# Altium schematic sheet LORA.SchDoc
size A; SheetNumber: 6; SheetTotal: 6
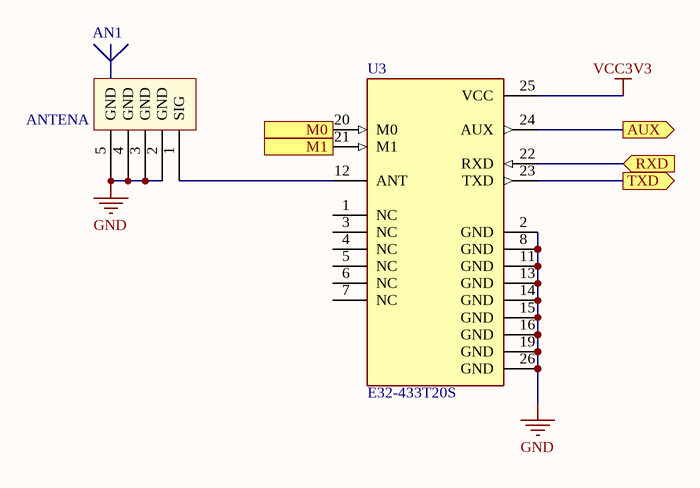
[diagram p0: LORA.SchDoc]

## Parts
AN1  ANTENA  [De Anten SMA SMD]
U3  E32-433T20S  [MODULE_E32-433T20S]

## Ports
AUX (out), M0 (in), M1 (in), RXD (in), TXD (out)

## Nets
GND: AN1.2(GND) AN1.3(GND) AN1.4(GND) AN1.5(GND) U3.2(GND) U3.8(GND) U3.11(GND) U3.13(GND) U3.14(GND) U3.15(GND) U3.16(GND) U3.19(GND) U3.26(GND)
VCC3V3: U3.25(VCC)
AUX: U3.24(AUX) ; port AUX
M0: U3.20(M0) ; port M0
M1: U3.21(M1) ; port M1
RXD: U3.22(RXD) ; port RXD
TXD: U3.23(TXD) ; port TXD
NetAN1_1: AN1.1(SIG) U3.12(ANT)

Not connected (* = marked no-connect by the designer): U3 1(NC) 3(NC) 4(NC) 5(NC) 6(NC) 7(NC)

## Library data of the parts
AN1 = ANTEN SMA THANG: Generic Antenna
U3 = E32-433T20S: Wireless serial port module (UART); MF: EBYTE; Check_prices: https://www.snapeda.com/parts/E32-433T20S/EBYTE/view-part/?ref=eda; Package: Package; MP: E32-433T20S; Value: *; SnapEDA_Link: https://www.snapeda.com/parts/E32-433T20S/EBYTE/view-part/?ref=snap; Price: None; Availability: Not in stock